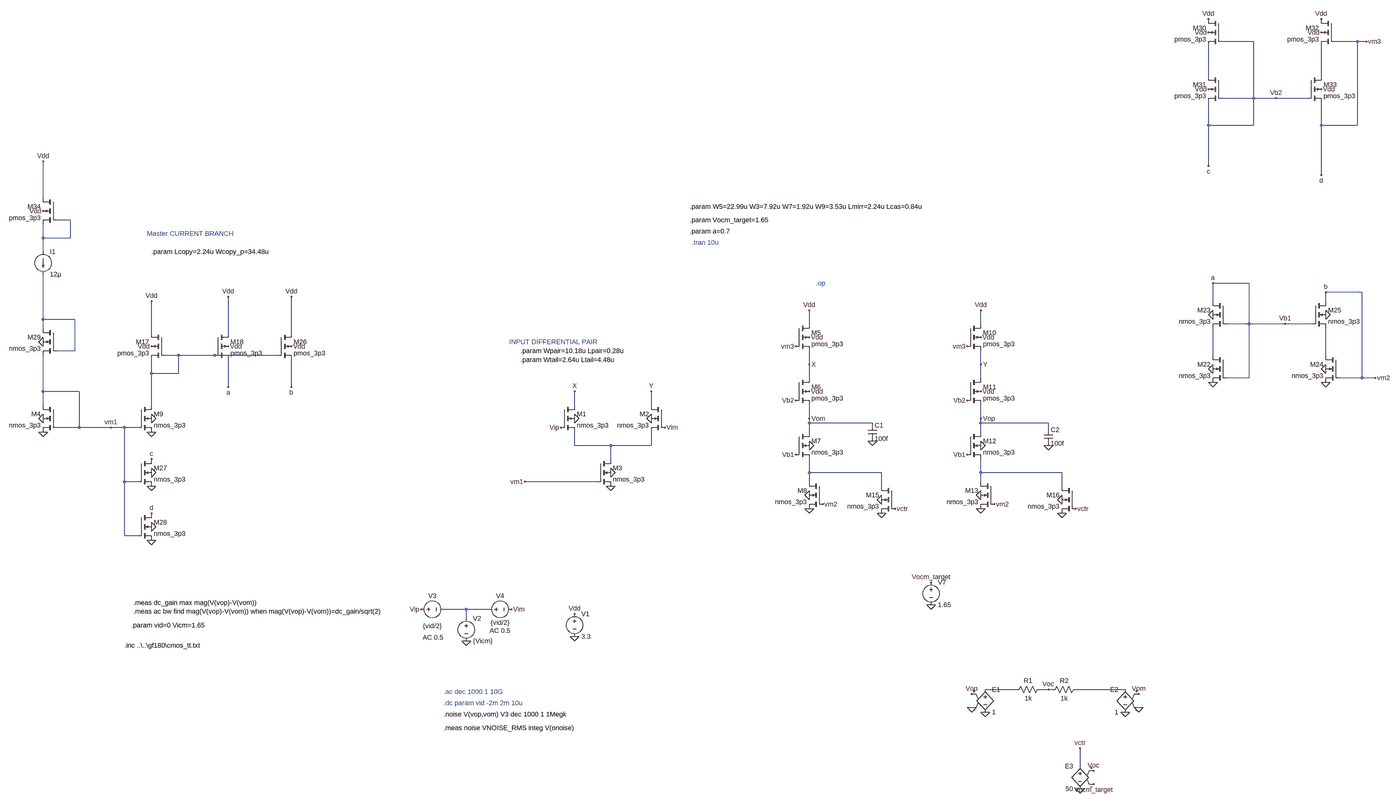
[diagram p0: schematic ota_OTRO.asc, whole sheet]
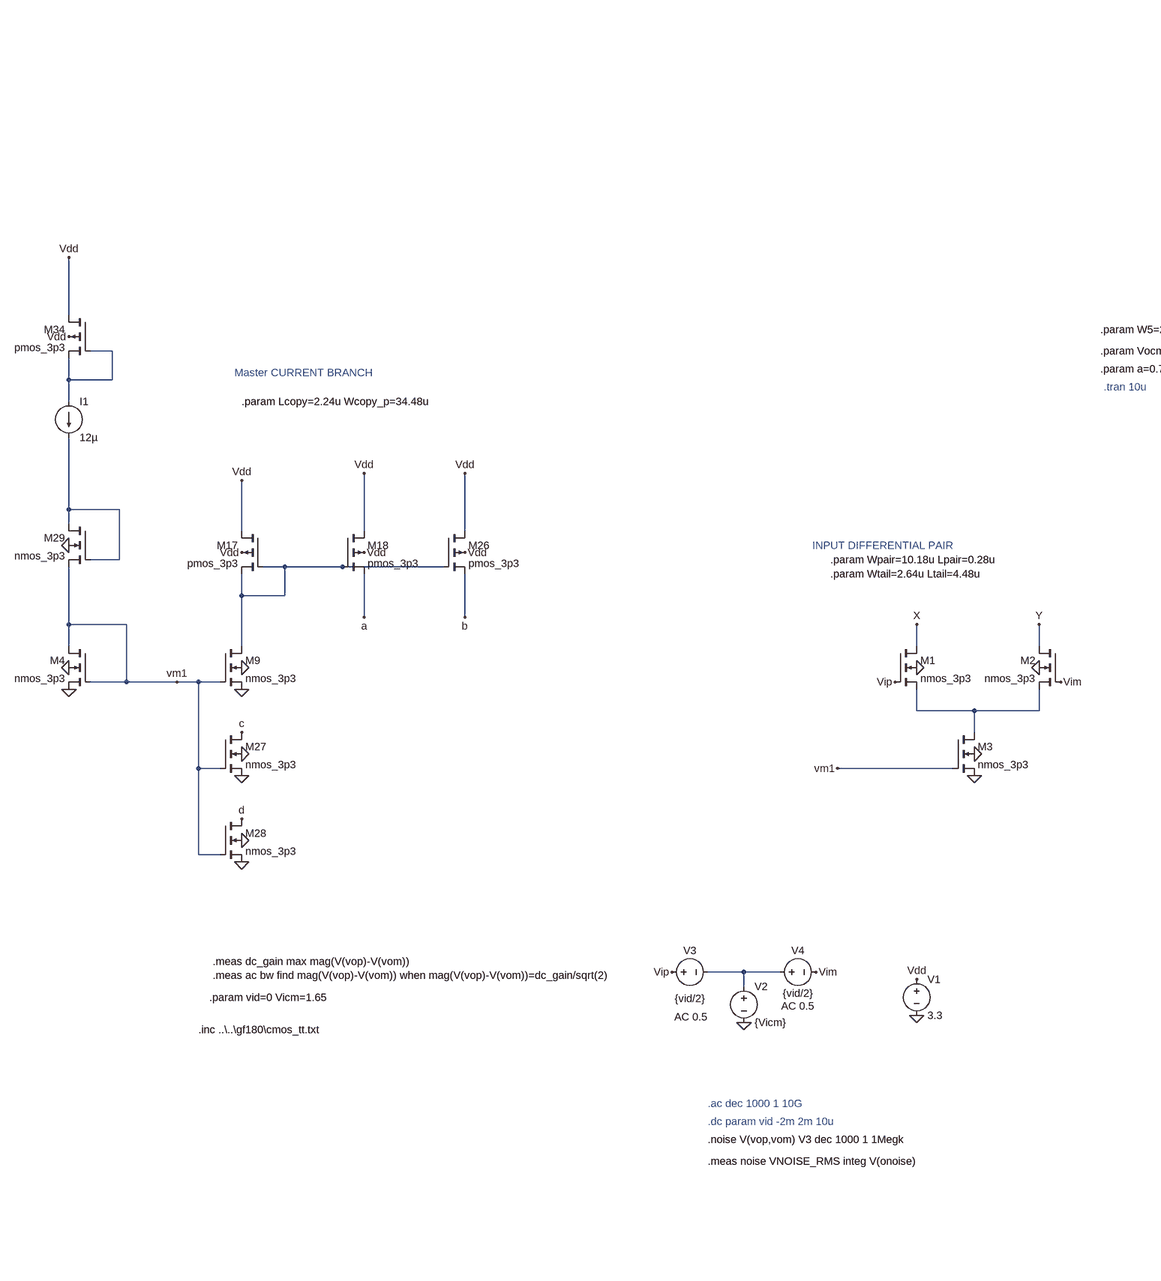
[diagram p1: schematic ota_OTRO.asc, part, row 1 of 1, column 1 of 2]
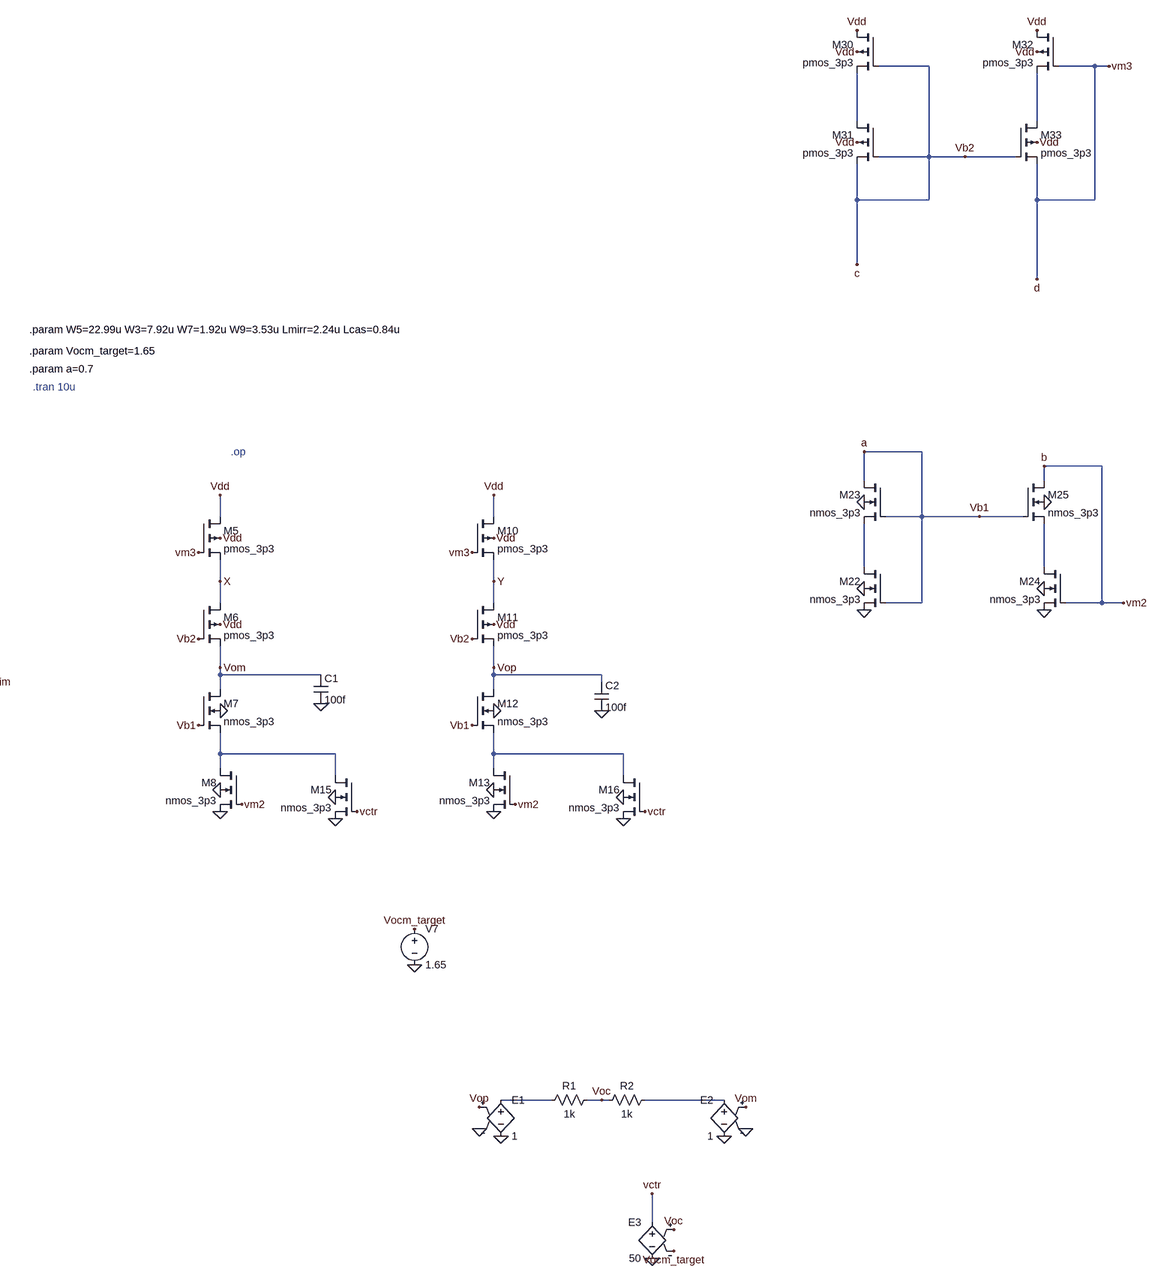
[diagram p2: schematic ota_OTRO.asc, part, row 1 of 1, column 2 of 2]
ota_OTRO.asc, the LTspice schematic file:
Version 4
SHEET 1 5940 1820
WIRE 3312 -1120 3200 -1120
WIRE 3680 -1120 3600 -1120
WIRE 3712 -1120 3680 -1120
WIRE 3152 -992 3152 -1104
WIRE 3552 -992 3552 -1104
WIRE 3312 -912 3312 -1120
WIRE 3312 -912 3200 -912
WIRE 3392 -912 3312 -912
WIRE 3504 -912 3392 -912
WIRE 3152 -816 3152 -896
WIRE 3312 -816 3312 -912
WIRE 3312 -816 3152 -816
WIRE 3552 -816 3552 -896
WIRE 3680 -816 3680 -1120
WIRE 3680 -816 3552 -816
WIRE 3152 -672 3152 -816
WIRE 3552 -640 3552 -816
WIRE -1936 -560 -1936 -688
WIRE -1840 -480 -1888 -480
WIRE -1936 -416 -1936 -464
WIRE -1840 -416 -1840 -480
WIRE -1840 -416 -1936 -416
WIRE -1936 -368 -1936 -416
WIRE 3296 -256 3168 -256
WIRE 3696 -224 3568 -224
WIRE 3168 -192 3168 -256
WIRE 3568 -192 3568 -224
WIRE -1936 -128 -1936 -288
WIRE -1824 -128 -1936 -128
WIRE 1040 -112 1040 -160
WIRE 1648 -112 1648 -160
WIRE 3296 -112 3296 -256
WIRE 3296 -112 3216 -112
WIRE 3424 -112 3296 -112
WIRE 3520 -112 3424 -112
WIRE -1936 -96 -1936 -128
WIRE -1552 -80 -1552 -192
WIRE -1280 -80 -1280 -208
WIRE -1056 -80 -1056 -208
WIRE -1824 -16 -1824 -128
WIRE -1824 -16 -1888 -16
WIRE -1456 0 -1504 0
WIRE -1328 0 -1456 0
WIRE -1104 0 -1328 0
WIRE 3168 0 3168 -96
WIRE 3568 0 3568 -96
WIRE 1040 32 1040 -16
WIRE 1648 32 1648 -16
WIRE -1552 64 -1552 16
WIRE -1456 64 -1456 0
WIRE -1456 64 -1552 64
WIRE 1040 80 1040 32
WIRE 1648 80 1648 32
WIRE 3296 80 3296 -112
WIRE 3296 80 3216 80
WIRE 3696 80 3696 -224
WIRE 3696 80 3616 80
WIRE 3744 80 3696 80
WIRE -1280 112 -1280 16
WIRE -1056 112 -1056 16
WIRE -1936 128 -1936 0
WIRE -1808 128 -1936 128
WIRE -1936 176 -1936 128
WIRE -1552 176 -1552 64
WIRE 208 176 208 128
WIRE 480 176 480 128
WIRE 1040 224 1040 176
WIRE 1648 224 1648 176
WIRE 1040 240 1040 224
WIRE 1264 240 1040 240
WIRE 1648 240 1648 224
WIRE 1888 240 1648 240
WIRE -1808 256 -1808 128
WIRE -1808 256 -1888 256
WIRE -1696 256 -1808 256
WIRE -1648 256 -1696 256
WIRE -1600 256 -1648 256
WIRE 1888 256 1888 240
WIRE 1040 272 1040 240
WIRE 1648 272 1648 240
WIRE 208 320 208 272
WIRE 336 320 208 320
WIRE 480 320 480 272
WIRE 480 320 336 320
WIRE 336 368 336 320
WIRE 1040 416 1040 368
WIRE 1296 416 1040 416
WIRE 1648 416 1648 368
WIRE 1936 416 1648 416
WIRE -1648 448 -1648 256
WIRE -1600 448 -1648 448
WIRE 288 448 32 448
WIRE 1040 448 1040 416
WIRE 1648 448 1648 416
WIRE 1296 464 1296 416
WIRE 1936 464 1936 416
WIRE -1648 640 -1648 448
WIRE -1600 640 -1648 640
WIRE -176 1056 -256 1056
WIRE -96 1056 -176 1056
WIRE -176 1088 -176 1056
WIRE 1776 1392 1664 1392
WIRE 1888 1392 1856 1392
WIRE 1904 1392 1888 1392
WIRE 2160 1392 1984 1392
WIRE 2000 1664 2000 1600
FLAG 336 464 0
FLAG 208 224 0
FLAG 480 224 0
FLAG 336 416 0
FLAG -1936 272 0
FLAG -1936 224 0
FLAG 208 1152 0
FLAG 208 1072 Vdd
FLAG -176 1168 0
FLAG -336 1056 Vip
FLAG -16 1056 Vim
FLAG 160 256 Vip
FLAG 528 256 Vim
FLAG 1040 -160 Vdd
FLAG 1040 544 0
FLAG 1040 496 0
FLAG 1040 320 0
FLAG 1040 32 X
FLAG 1040 128 Vdd
FLAG 992 352 Vb1
FLAG 992 160 Vb2
FLAG 1040 -64 Vdd
FLAG 1648 -160 Vdd
FLAG 1648 544 0
FLAG 1648 496 0
FLAG 1648 320 0
FLAG 1648 32 Y
FLAG 1648 128 Vdd
FLAG 1600 352 Vb1
FLAG 1600 160 Vb2
FLAG 1648 -64 Vdd
FLAG 1696 528 vm2
FLAG 1088 528 vm2
FLAG 1600 -32 vm3
FLAG 992 -32 vm3
FLAG 1648 224 Vop
FLAG 1040 224 Vom
FLAG 208 128 X
FLAG 480 128 Y
FLAG 1472 1040 0
FLAG 1472 960 Vocm_target
FLAG -1696 256 vm1
FLAG 1296 560 0
FLAG 1296 512 0
FLAG 1344 544 vctr
FLAG 1936 560 0
FLAG 1936 512 0
FLAG 1984 544 vctr
FLAG 1264 304 0
FLAG 1888 320 0
FLAG 32 448 vm1
FLAG 3168 96 0
FLAG 3168 48 0
FLAG 3168 -144 0
FLAG 3568 96 0
FLAG 3568 48 0
FLAG 3744 80 vm2
FLAG 3568 -144 0
FLAG 3424 -112 Vb1
FLAG 3152 -1152 Vdd
FLAG 3152 -1200 Vdd
FLAG 3152 -944 Vdd
FLAG 3552 -1152 Vdd
FLAG 3552 -1200 Vdd
FLAG 3552 -944 Vdd
FLAG 3712 -1120 vm3
FLAG 3392 -912 Vb2
FLAG -1552 272 0
FLAG -1552 224 0
FLAG -1552 -32 Vdd
FLAG -1552 -192 Vdd
FLAG -1280 -32 Vdd
FLAG -1280 -208 Vdd
FLAG -1056 -32 Vdd
FLAG -1056 -208 Vdd
FLAG -1280 112 a
FLAG -1056 112 b
FLAG 3168 -256 a
FLAG 3568 -224 b
FLAG -1552 464 0
FLAG -1552 416 0
FLAG -1552 656 0
FLAG -1552 608 0
FLAG -1552 368 c
FLAG -1552 560 d
FLAG 3152 -672 c
FLAG 3552 -640 d
FLAG -1936 -688 Vdd
FLAG -1936 -48 0
FLAG -1936 -512 Vdd
FLAG 1616 1408 Vop
FLAG 1664 1472 0
FLAG 1616 1456 0
FLAG 2208 1408 Vom
FLAG 2160 1472 0
FLAG 2208 1456 0
FLAG 1888 1392 Voc
FLAG 2048 1680 Voc
FLAG 2048 1728 Vocm_target
FLAG 2000 1744 0
FLAG 2000 1600 vctr
SYMBOL nmos4 160 176 R0
SYMATTR InstName M1
SYMATTR Value nmos_3p3
SYMATTR Value2 l='Lpair' w='Wpair' m=1
SYMBOL nmos4 528 176 M0
SYMATTR InstName M2
SYMATTR Value nmos_3p3
SYMATTR Value2 l='Lpair' w='Wpair' m=1
SYMBOL nmos4 288 368 R0
SYMATTR InstName M3
SYMATTR Value nmos_3p3
SYMATTR Value2 l='Ltail' w='Wtail' m=1
SYMBOL nmos4 -1888 176 M0
SYMATTR InstName M4
SYMATTR Value nmos_3p3
SYMATTR Value2 l='Ltail' w='Wtail' m=6
SYMBOL voltage 208 1056 R0
WINDOW 123 24 124 Left 2
WINDOW 39 0 0 Left 0
SYMATTR InstName V1
SYMATTR Value 3.3
SYMBOL voltage -176 1072 R0
WINDOW 123 24 124 Left 2
WINDOW 39 0 0 Left 0
SYMATTR InstName V2
SYMATTR Value {Vicm}
SYMBOL voltage -352 1056 R270
WINDOW 0 32 56 VTop 2
WINDOW 3 -43 56 VBottom 2
WINDOW 123 -84 58 VBottom 2
WINDOW 39 0 0 Left 0
SYMATTR InstName V3
SYMATTR Value {vid/2}
SYMATTR Value2 AC 0.5
SYMBOL voltage -112 1056 R270
WINDOW 0 32 56 VTop 2
WINDOW 3 -32 56 VBottom 2
WINDOW 123 -60 56 VBottom 2
WINDOW 39 0 0 Left 0
SYMATTR InstName V4
SYMATTR Value {vid/2}
SYMATTR Value2 AC 0.5
SYMBOL pmos4 992 -112 R0
SYMATTR InstName M5
SYMATTR Value pmos_3p3
SYMATTR Value2 l='Lmirr' w='W5'
SYMBOL pmos4 992 80 R0
SYMATTR InstName M6
SYMATTR Value pmos_3p3
SYMATTR Value2 l='Lcas' w='W3'
SYMBOL nmos4 992 272 R0
SYMATTR InstName M7
SYMATTR Value nmos_3p3
SYMATTR Value2 l='Lcas' w='W7'
SYMBOL nmos4 1088 448 M0
SYMATTR InstName M8
SYMATTR Value nmos_3p3
SYMATTR Value2 l='Lmirr' w='a*W9'
SYMBOL pmos4 1600 -112 R0
SYMATTR InstName M10
SYMATTR Value pmos_3p3
SYMATTR Value2 l='Lmirr' w='W5'
SYMBOL pmos4 1600 80 R0
SYMATTR InstName M11
SYMATTR Value pmos_3p3
SYMATTR Value2 l='Lcas' w='W3'
SYMBOL nmos4 1600 272 R0
SYMATTR InstName M12
SYMATTR Value nmos_3p3
SYMATTR Value2 l='Lcas' w='W7'
SYMBOL nmos4 1696 448 M0
SYMATTR InstName M13
SYMATTR Value nmos_3p3
SYMATTR Value2 l='Lmirr' w='a*W9'
SYMBOL voltage 1472 944 R0
WINDOW 123 0 0 Left 0
WINDOW 39 0 0 Left 0
SYMATTR InstName V7
SYMATTR Value 1.65
SYMBOL nmos4 1344 464 M0
SYMATTR InstName M15
SYMATTR Value nmos_3p3
SYMATTR Value2 l='Lmirr' w='(1-a)*W9'
SYMBOL nmos4 1984 464 M0
SYMATTR InstName M16
SYMATTR Value nmos_3p3
SYMATTR Value2 l='Lmirr' w='(1-a)*W9'
SYMBOL cap 1248 240 R0
SYMATTR InstName C1
SYMATTR Value 100f
SYMBOL cap 1872 256 R0
SYMATTR InstName C2
SYMATTR Value 100f
SYMBOL current -1936 -368 R0
WINDOW 123 0 0 Left 0
WINDOW 39 0 0 Left 0
SYMATTR InstName I1
SYMATTR Value 12µ
SYMBOL nmos4 3216 0 M0
SYMATTR InstName M22
SYMATTR Value nmos_3p3
SYMATTR Value2 l='Lmirr' w='(1/5)*W9' m=6
SYMBOL nmos4 3216 -192 M0
SYMATTR InstName M23
SYMATTR Value nmos_3p3
SYMATTR Value2 l='Lcas' w='W7' m=6
SYMBOL nmos4 3616 0 M0
SYMATTR InstName M24
SYMATTR Value nmos_3p3
SYMATTR Value2 l='Lmirr' w='W9' m=6
SYMBOL nmos4 3520 -192 R0
SYMATTR InstName M25
SYMATTR Value nmos_3p3
SYMATTR Value2 l='Lcas' w='W7' m=6
SYMBOL pmos4 3200 -1200 M0
SYMATTR InstName M30
SYMATTR Value pmos_3p3
SYMATTR Value2 l='Lmirr' w='(1/5)*W5'
SYMBOL pmos4 3200 -992 M0
SYMATTR InstName M31
SYMATTR Value pmos_3p3
SYMATTR Value2 l='Lcas' w='W3' m=6
SYMBOL pmos4 3600 -1200 M0
SYMATTR InstName M32
SYMATTR Value pmos_3p3
SYMATTR Value2 l='Lmirr' w='W5' m=4
SYMBOL pmos4 3504 -992 R0
SYMATTR InstName M33
SYMATTR Value pmos_3p3
SYMATTR Value2 l='Lcas' w='W3' m=6
SYMBOL nmos4 -1600 176 R0
SYMATTR InstName M9
SYMATTR Value nmos_3p3
SYMATTR Value2 l=4.48u w=2.64u m=6
SYMBOL pmos4 -1504 -80 M0
SYMATTR InstName M17
SYMATTR Value pmos_3p3
SYMATTR Value2 l='Lcopy' w='Wcopy_p'
SYMBOL pmos4 -1328 -80 R0
SYMATTR InstName M18
SYMATTR Value pmos_3p3
SYMATTR Value2 l='Lcopy' w='Wcopy_p'
SYMBOL pmos4 -1104 -80 R0
SYMATTR InstName M26
SYMATTR Value pmos_3p3
SYMATTR Value2 l='Lcopy' w='Wcopy_p'
SYMBOL nmos4 -1600 368 R0
SYMATTR InstName M27
SYMATTR Value nmos_3p3
SYMATTR Value2 l='Ltail' w='Wtail' m=6
SYMBOL nmos4 -1600 560 R0
SYMATTR InstName M28
SYMATTR Value nmos_3p3
SYMATTR Value2 l='Ltail' w='Wtail' m=6
SYMBOL nmos4 -1888 -96 M0
SYMATTR InstName M29
SYMATTR Value nmos_3p3
SYMATTR Value2 l=4.48u w=2.64u m=6
SYMBOL pmos4 -1888 -560 M0
SYMATTR InstName M34
SYMATTR Value pmos_3p3
SYMATTR Value2 l=0.28u w='Wcopy_p'
SYMBOL res 1872 1376 R90
WINDOW 0 0 56 VBottom 2
WINDOW 3 32 56 VTop 2
SYMATTR InstName R1
SYMATTR Value 1k
SYMBOL res 2000 1376 R90
WINDOW 0 0 56 VBottom 2
WINDOW 3 32 56 VTop 2
SYMATTR InstName R2
SYMATTR Value 1k
SYMBOL e 1664 1376 R0
SYMATTR InstName E1
SYMATTR Value 1
SYMBOL e 2160 1376 M0
SYMATTR InstName E2
SYMATTR Value 1
SYMBOL e 2000 1648 M0
SYMATTR InstName E3
SYMATTR Value 50
TEXT 16 -16 Left 2 !.param Wpair=10.18u Lpair=0.28u
TEXT 16 16 Left 2 !.param Wtail=2.64u Ltail=4.48u
TEXT -1624 1112 Left 2 !.param vid=0 Vicm=1.65
TEXT -1648 1184 Left 2 !.inc ..\\..\\gf180\\cmos_tt.txt
TEXT 1064 -256 Left 2 ;.op
TEXT 616 -528 Left 2 !.param W5=22.99u W3=7.92u W7=1.92u W9=3.53u Lmirr=2.24u Lcas=0.84u
TEXT 616 -480 Left 2 !.param Vocm_target=1.65
TEXT 624 -400 Left 2 ;.tran 10u
TEXT 616 -440 Left 2 !.param a=0.7
TEXT -256 1400 Left 2 ;.ac dec 1000 1 10G
TEXT -256 1440 Left 2 ;.dc param vid -2m 2m 10u
TEXT -1616 1032 Left 2 !.meas dc_gain max mag(V(vop)-V(vom))\n.meas ac bw find mag(V(vop)-V(vom)) when mag(V(vop)-V(vom))=dc_gain/sqrt(2)
TEXT -1552 -368 Left 2 !.param Lcopy=2.24u Wcopy_p=34.48u
TEXT -1568 -432 Left 2 ;Master CURRENT BRANCH
TEXT -24 -48 Left 2 ;INPUT DIFFERENTIAL PAIR
TEXT -256 1480 Left 2 !.noise V(vop,vom) V3 dec 1000 1 1Megk
TEXT -256 1528 Left 2 !.meas noise VNOISE_RMS integ V(onoise)

The netlist it stands for:
* ota_OTRO.asc
M1 X Vip N008 0 nmos_3p3 l='Lpair' w='Wpair' m=1
M2 Y Vim N008 0 nmos_3p3 l='Lpair' w='Wpair' m=1
M3 N008 vm1 0 0 nmos_3p3 l='Ltail' w='Wtail' m=1
M4 vm1 vm1 0 0 nmos_3p3 l='Ltail' w='Wtail' m=6
V1 Vdd 0 3.3
V2 N011 0 {Vicm}
V3 Vip N011 {vid/2} AC 0.5
V4 N011 Vim {vid/2} AC 0.5
M5 Vdd d X Vdd pmos_3p3 l='Lmirr' w='W5'
M6 X c Vom Vdd pmos_3p3 l='Lcas' w='W3'
M7 Vom a N009 0 nmos_3p3 l='Lcas' w='W7'
M8 N009 b 0 0 nmos_3p3 l='Lmirr' w='a*W9'
M10 Vdd d Y Vdd pmos_3p3 l='Lmirr' w='W5'
M11 Y c Vop Vdd pmos_3p3 l='Lcas' w='W3'
M12 Vop a N010 0 nmos_3p3 l='Lcas' w='W7'
M13 N010 b 0 0 nmos_3p3 l='Lmirr' w='a*W9'
V7 Vocm_target 0 1.65
M15 N009 vctr 0 0 nmos_3p3 l='Lmirr' w='(1-a)*W9'
M16 N010 vctr 0 0 nmos_3p3 l='Lmirr' w='(1-a)*W9'
C1 Vom 0 100f
C2 Vop 0 100f
I1 N003 N004 12µ
M22 N006 a 0 0 nmos_3p3 l='Lmirr' w='(1/5)*W9' m=6
M23 a a N006 0 nmos_3p3 l='Lcas' w='W7' m=6
M24 N007 b 0 0 nmos_3p3 l='Lmirr' w='W9' m=6
M25 b a N007 0 nmos_3p3 l='Lcas' w='W7' m=6
M30 Vdd c N001 Vdd pmos_3p3 l='Lmirr' w='(1/5)*W5'
M31 N001 c c Vdd pmos_3p3 l='Lcas' w='W3' m=6
M32 Vdd d N002 Vdd pmos_3p3 l='Lmirr' w='W5' m=4
M33 N002 c d Vdd pmos_3p3 l='Lcas' w='W3' m=6
M9 N005 vm1 0 0 nmos_3p3 l=4.48u w=2.64u m=6
M17 Vdd N005 N005 Vdd pmos_3p3 l='Lcopy' w='Wcopy_p'
M18 Vdd N005 a Vdd pmos_3p3 l='Lcopy' w='Wcopy_p'
M26 Vdd N005 b Vdd pmos_3p3 l='Lcopy' w='Wcopy_p'
M27 c vm1 0 0 nmos_3p3 l='Ltail' w='Wtail' m=6
M28 d vm1 0 0 nmos_3p3 l='Ltail' w='Wtail' m=6
M29 N004 N004 vm1 0 nmos_3p3 l=4.48u w=2.64u m=6
M34 Vdd N003 N003 Vdd pmos_3p3 l=0.28u w='Wcopy_p'
R1 Voc N012 1k
R2 N013 Voc 1k
E1 N012 0 Vop 0 1
E2 N013 0 Vom 0 1
E3 vctr 0 Voc Vocm_target 50
.model NMOS NMOS
.model PMOS PMOS
.lib standard.mos
.param Wpair=10.18u Lpair=0.28u
.param Wtail=2.64u Ltail=4.48u
.param vid=0 Vicm=1.65
.inc ..\..\gf180\cmos_tt.txt
* .op
.param W5=22.99u W3=7.92u W7=1.92u W9=3.53u Lmirr=2.24u Lcas=0.84u
.param Vocm_target=1.65
* .tran 10u
.param a=0.7
* .ac dec 1000 1 10G
* .dc param vid -2m 2m 10u
.meas dc_gain max mag(V(vop)-V(vom))
.meas ac bw find mag(V(vop)-V(vom)) when mag(V(vop)-V(vom))=dc_gain/sqrt(2)
.param Lcopy=2.24u Wcopy_p=34.48u
* Master CURRENT BRANCH
* INPUT DIFFERENTIAL PAIR
.noise V(vop,vom) V3 dec 1000 1 1Megk
.meas noise VNOISE_RMS integ V(onoise)
.backanno
.end